# Altium schematic sheet NAVC_Peripherals.SchDoc
size A4; SheetNumber: 3; SheetTotal: 8
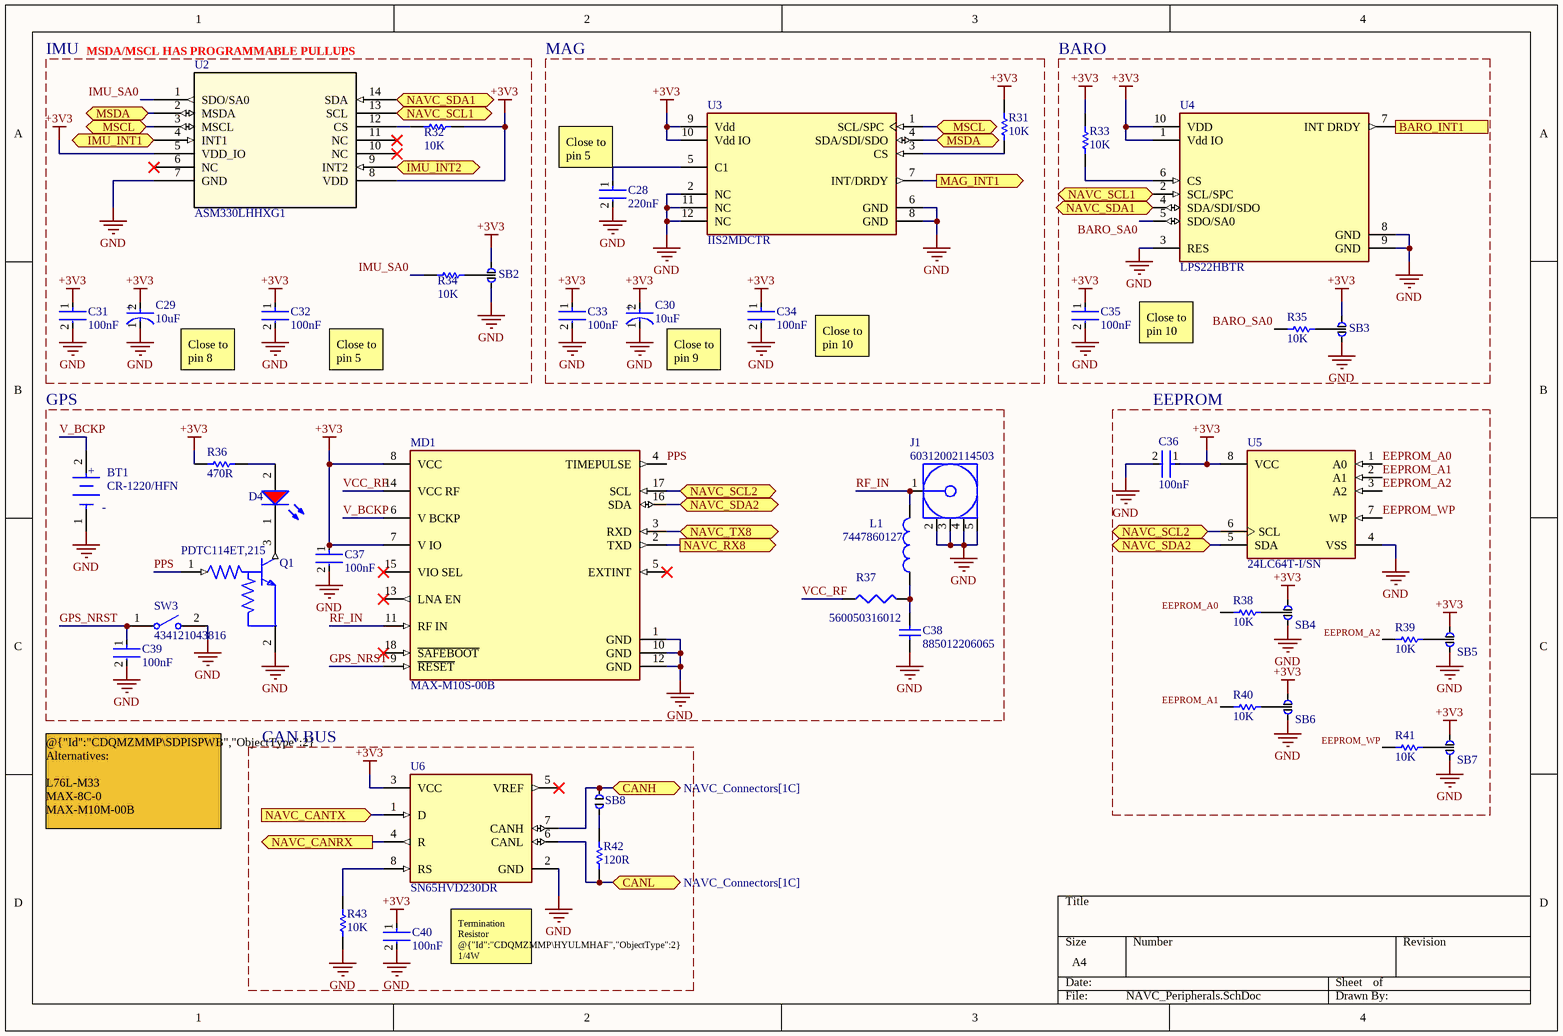
[diagram p0: NAVC_Peripherals.SchDoc]

## Parts
BT1  CR-1220/HFN  [FP-CR-1220-HFN-MFG]
C28  220nF  [FP-C0603C-CF-MFG]
C29  10uF  [FP-T491A106K006AT-MFG]
C30  10uF  [FP-T491A106K006AT-MFG]
C31  100nF  [FP-CGA3E-0_3-0_1-IPC_A]
C32  100nF  [FP-CGA3E-0_3-0_1-IPC_A]
C33  100nF  [FP-CGA3E-0_3-0_1-IPC_A]
C34  100nF  [FP-CGA3E-0_3-0_1-IPC_A]
C35  100nF  [FP-CGA3E-0_3-0_1-IPC_A]
C36  100nF  [FP-CGA3E-0_3-0_1-IPC_A]
C37  100nF  [FP-CGA3E-0_3-0_1-IPC_A]
C38  885012206065  [WCAP-CSGP_0603_L1.6W0.8H0.8_Reflow]
C39  100nF  [FP-CGA3E-0_3-0_1-IPC_A]
C40  100nF  [FP-CGA3E-0_3-0_1-IPC_A]
D4  150120SS75000  [WL-SMCW_1206_150120xx75000]  (value not drawn)
J1  60312002114503  [60312002114503]
L1  7447860127  [WE-MK_0603_L1.6W0.8H0.8]
MD1  MAX-M10S-00B  [FP-MAX-M10S-00B-MFG]
Q1  PDTC114ET,215  [FP-SOT23-MFG]
R31  10K  [RESC1609X50X30NL8T20]
R32  10K  [RESC1609X50X30NL8T20]
R33  10K  [RESC1609X50X30NL8T20]
R34  10K  [RESC1609X50X30NL8T20]
R35  10K  [RESC1609X50X30NL8T20]
R36  470R  [RESC1609X50X30NL8T20]
R37  560050316012  [WRIS-KSKE_0603_L1.6W0.8H0.45]
R38  10K  [RESC1608X55X25ML10T15]
R39  10K  [RESC1608X55X25ML10T15]
R40  10K  [RESC1608X55X25ML10T15]
R41  10K  [RESC1608X55X25ML10T15]
R42  120R  [RESC1608X55X25ML10T15]
R43  10K  [RESC1608X55X25ML10T15]
SB2  Solderbridge3P  [SolderBridge3P]  (value not drawn)
SB3  Solderbridge3P  [SolderBridge3P]  (value not drawn)
SB4  Solderbridge3P  [SolderBridge3P]  (value not drawn)
SB5  Solderbridge3P  [SolderBridge3P]  (value not drawn)
SB6  Solderbridge3P  [SolderBridge3P]  (value not drawn)
SB7  Solderbridge3P  [SolderBridge3P]  (value not drawn)
SB8  SolderbridgeOpen  [SolderBridgeOpen]  (value not drawn)
SW3  434121043816  [434121043816]
U2  ASM330LHHXG1  [LGA-14L_STM]
U3  IIS2MDCTR  [FP-LGA-12-DM00170568-MFG]
U4  LPS22HBTR  [FP-HLGA-10L-8479831-0]
U5  24LC64T-I/SN  [FP-C04-057-SN-MFG]
U6  SN65HVD230DR  [FP-D0008A-IPC_A]

## Blocks framed on the sheet
IMU: C29 C31 C32 R32 R34 SB2 U2
MAG: C28 C30 C33 C34 R31 U3
BARO: C35 R33 R35 SB3 U4
GPS: BT1 C37-C39 D4 J1 L1 MD1 Q1 R36 R37 SW3
EEPROM: C36 R38-R41 SB4-SB7 U5
CAN BUS: C40 R42 R43 SB8 U6

## Ports
BARO_INT1 (out, see NAVC_MCU[2A]), CANH (bidir, see NAVC_Connectors[1C]), CANL (bidir, see NAVC_Connectors[1C]), IMU_INT1 (bidir, see NAVC_MCU[2A]), IMU_INT2 (bidir, see NAVC_MCU[2A]), MAG_INT1 (out, see NAVC_MCU[2A]), MSCL (bidir, see NAVC_Peripherals[1A]), MSCL (bidir, see NAVC_Peripherals[3A]), MSDA (bidir, see NAVC_Peripherals[1A]), MSDA (bidir, see NAVC_Peripherals[3A]), NAVC_CANRX (out, see NAVC_MCU[1A]), NAVC_CANTX (in, see NAVC_MCU[1B]), NAVC_RX8 (out, see NAVC_MCU[1C], NAVC_MCU[2D]), NAVC_SCL1 (bidir, see NAVC_MCU[2A], NAVC_MCU[2D], NAVC_Peripherals[2A]), NAVC_SCL1 (bidir, see NAVC_MCU[2A], NAVC_MCU[2D], NAVC_Peripherals[3A]), NAVC_SCL2 (bidir, see NAVC_MCU[2C], NAVC_MCU[2D], NAVC_Peripherals[2B]), NAVC_SCL2 (bidir, see NAVC_MCU[2C], NAVC_MCU[2D], NAVC_Peripherals[3C]), NAVC_SDA1 (bidir, see NAVC_MCU[2A], NAVC_MCU[2D], NAVC_Peripherals[2A]), NAVC_SDA1 (bidir, see NAVC_MCU[2A], NAVC_MCU[2D], NAVC_Peripherals[3A]), NAVC_SDA2 (bidir, see NAVC_MCU[2C], NAVC_MCU[2D], NAVC_Peripherals[2B]), NAVC_SDA2 (bidir, see NAVC_MCU[2C], NAVC_MCU[2D], NAVC_Peripherals[3C]), NAVC_TX8 (bidir, see NAVC_MCU[1C], NAVC_MCU[2D])

## Nets
+3V3: C29.2(A) C30.2(A) C31.1 C32.1 C33.1 C34.1 C35.1 C36.1 C37.1 C40.1 MD1.7(V_IO) MD1.8(VCC) R31.2 R32.1 R33.2 R36.2 SB2.1 SB3.1 SB4.1 SB5.1 SB6.1 SB7.1 U2.5(VDD_IO) U2.8(VDD) U3.9(Vdd) U3.10(Vdd_IO) U4.1(Vdd_IO) U4.10(VDD) U5.8(VCC) U6.3(VCC)
GND: BT1.1(C) C28.2 C29.1(C) C30.1(C) C31.2 C32.2 C33.2 C34.2 C35.2 C36.2 C37.2 C38.1 C39.2 C40.2 J1.2(GND) J1.3(GND) J1.4(GND) J1.5(GND) MD1.1(GND) MD1.10(GND) MD1.12(GND) Q1.2(GND) R43.2 SB2.2 SB3.2 SB4.2 SB5.2 SB6.2 SB7.2 SW3.2 U2.7(GND) U3.2(NC) U3.6(GND) U3.8(GND) U3.11(NC) U3.12(NC) U4.3(RES) U4.8(GND) U4.9(GND) U5.4(VSS) U6.2(GND)
BARO_INT1: U4.7(INT_DRDY) ; port BARO_INT1
BARO_SA0: R35.2 U4.5(SDO/SA0)
CANH: SB8.2 U6.7(CANH) ; port CANH
CANL: R42.2 U6.6(CANL) ; port CANL
EEPROM_A0: R38.2 U5.1(A0)
EEPROM_A1: R40.2 U5.2(A1)
EEPROM_A2: R39.2 U5.3(A2)
EEPROM_WP: R41.2 U5.7(WP)
GPS_NRST: C39.1 MD1.9(~{RESET}) SW3.1
IMU_INT1: U2.4(INT1) ; port IMU_INT1
IMU_INT2: U2.9(INT2) ; port IMU_INT2
IMU_SA0: R34.2 U2.1(SDO/SA0)
MAG_INT1: U3.7(INT/DRDY) ; port MAG_INT1
MSCL: U2.3(MSCL) U3.1(SCL/SPC) ; port MSCL
MSDA: U2.2(MSDA) U3.4(SDA/SDI/SDO) ; port MSDA
NAVC_CANRX: U6.4(R) ; port NAVC_CANRX
NAVC_CANTX: U6.1(D) ; port NAVC_CANTX
NAVC_RX8: MD1.2(TXD) ; port NAVC_RX8
NAVC_SCL1: U2.13(SCL) U4.2(SCL/SPC) ; port NAVC_SCL1
NAVC_SCL2: MD1.17(SCL) U5.6(SCL) ; port NAVC_SCL2
NAVC_SDA1: U2.14(SDA) U4.4(SDA/SDI/SDO) ; port NAVC_SDA1
NAVC_SDA2: MD1.16(SDA) U5.5(SDA) ; port NAVC_SDA2
NAVC_TX8: MD1.3(RXD) ; port NAVC_TX8
PPS: MD1.4(TIMEPULSE) Q1.1(I)
RF_IN: J1.1(Signal) L1.2 MD1.11(RF_IN)
V_BCKP: BT1.2(A) MD1.6(V_BCKP)
VCC_RF: MD1.14(VCC_RF) R37.1
NetC28_1: C28.1 U3.5(C1)
NetC38_2: C38.2 L1.1 R37.2
NetD4_1: D4.1(K) Q1.3(O)
NetD4_2: D4.2(A) R36.1
NetR31_1: R31.1 U3.3(CS)
NetR32_2: R32.2 U2.12(CS)
NetR33_1: R33.1 U4.6(CS)
NetR34_1: R34.1 SB2.3
NetR35_1: R35.1 SB3.3
NetR38_1: R38.1 SB4.3
NetR39_1: R39.1 SB5.3
NetR40_1: R40.1 SB6.3
NetR41_1: R41.1 SB7.3
NetR42_1: R42.1 SB8.1
NetR43_1: R43.1 U6.8(RS)

Not connected (* = marked no-connect by the designer): MD1 5(EXTINT)* 13(LNA_EN)* 15(VIO_SEL)* 18(~{SAFEBOOT})*; U2 6(NC)* 10(NC)* 11(NC)*; U6 5(VREF)*

## Notes on the sheet
- (near U2) MSDA/MSCL HAS PROGRAMMABLE PULLUPS
- (near C28) Close to pin 5
- Close to pin 8
- Close to pin 5
- Close to pin 9
- Close to pin 10
- @{"Id":"CDQMZMMP\SDPISPWB","ObjectType":2} Alternatives:
  L76L-M33
  MAX-8C-0
  MAX-M10M-00B
- Termination Resistor @{"Id":"CDQMZMMP\HYULMHAF","ObjectType":2} 1/4W
- (in symbol CMP-03017-000032-1) +
- (in symbol CMP-05417-000010-1) +; -

## Library data of the parts
BT1 = CMP-05417-000010-1: BATTERY LITHIUM 3V COIN 12.5MM; Manufacturer: Panasonic; Standoff Height: 2.9mm; Temperature Range High: +60°C; Temperature: -30°C to +60°C; Device Class L2: unset; Height: 5.5mm; Category: Batt; Device Class L3: unset; Package: CR-1220/HFN; ComponentLink2URL: https://industrial.panasonic.com/cdbs/www-data/pdf2/AAA4000/AAA4000D138.PDF; ComponentLink2Description: Datasheet; Temperature Range Low: -30°C; Mouser Description: CR1220 Series Ø 12.5 mm 3 V 35 mAh Non-Rechargeable Lithium Coin Cell Battery; Octopart: https://octopart.com/cr-1220%2Fhfn-panasonic-13183313; Manufacturer Part Number: CR-1220/HFN; Automotive: No; Digikey Description: BATTERY LITHIUM 3V COIN 12.5MM; Device Class L1: Passive Components
C28 = CMP-2006-03146-2: CAP CER 0.22UF 25V 10% X7R 0603; Manufacturer: KEMET; Manufacturer Part Number: C0603C224K3RACTU; Temperature Coefficient: 30ppm/°C; Value: 0.22 μF; Material: Ceramic; Tolerance: 0.1; Automotive Grade: Grade 1; Device Class L2: Capacitors; Automotive: Yes; RoHS: TRUE; Digikey Description: CAP CER 0.22UF 25V 10% X7R 0603; Package: C0603C-CF; Height: 0.87mm; Temperature Characteristic: X7R; Mouser Description: Multilayer Ceramic Capacitors MLCC - SMD/SMT 25volts 0.22uF X7R 10%; Device Class L3: Ceramic Capacitors; Lead Free: Yes; Capacitance: 0.22 μF; Device Class L1: Passive Components; ComponentLink2Description: Datasheet; Temperature: -55°C to +125°C; Voltage Rating: 25 V; Temperature Range Low: -55°C; ComponentLink2URL: https://api.kemet.com/component-edge/download/datasheet/C0603C100J5GACAUTO.pdf; Octopart: https://octopart.com/c0603c224k3ractu-kemet-129141; Temperature Range High: +125°C; Category: Cap
C29 C30 = CMP-03017-000032-1: CAP TANT 10UF 10% 6.3V 1206; Life (Hours): 2000Hour; Polarity: Polar; Dielectric Material: Tantalum; Leakage Current: 600nA; Dissipation Factor: 6%; ESR (Equivalent Series Resistance): 4R; Lead Free: Lead Free; Features: General Purpose; Length: 3.2mm; Mount: Surface Mount; Number of Pins: 2; RoHS Compliant: Yes; Case/Package: 1206; Width: 1.6mm; Capacitance: 10uF; REACH SVHC: No SVHC; Voltage Rating (DC): 6.3V; Max Operating Temperature: 125°C; Height - Seated (Max): 0.071inch; Termination: SMD/SMT; Radiation Hardening: No; Tolerance: 10%; Min Operating Temperature: -55°C; Lead Pitch: 1.2mm; Voltage: 6.3V; Depth: 1.6mm; Case Code (Imperial): 1206; Case Code (Metric): 3216; Packaging: Tape and Reel; Height: 1.6mm; Voltage Rating: 6.3V; Package Quantity: 1
C31-C37 C39 C40 = CMP-2000-07546-2: Cap Ceramic 100nF 50V X7R 10% Pad SMD 0603 +125°C Automotive T/R; Weight: 7.1E-05oz; Composition: Ceramic; Max Operating Temperature: 125°C; Termination: SMD/SMT; Dielectric: X7R; Length: 1.6mm; Package Quantity: 1; REACH SVHC: No SVHC; Lead Free: Lead Free; Case Code (Metric): 1608; Min Operating Temperature: -55°C; Packaging: Tape and Reel; Tolerance: 10%; Voltage Rating: 50V; Case Code (Imperial): 0603; Capacitance: 100nF; Case/Package: 0603; Voltage Rating (DC): 50V; Depth: 0.8mm; Radiation Hardening: No; Ratings: AEC-Q200; Mount: Surface Mount; Voltage: 50V; Thickness: 0.035inch; Width: 0.8mm; Height: 0.8mm
C38 = CMP-03913-53914774-1: 885012206065 Cap Cer 10000PF 25V X7R 0603; Insulation Resistance: 10GΩ; Tolerance: 10%; Capacitance: 10nF; REACH SVHC: Unknown; Height: 800µm; NexarPartId: 53914774; Case Code (Metric): 1608; Voltage Rating: 25V; Case Code (Imperial): 0603; Width: 800µm; Max Operating Temperature: 125°C; Min Operating Temperature: -55°C; Mount: Surface Mount; Voltage Rating (DC): 25V; Length: 1.6mm; Dielectric: X7R; Case/Package: 0603; Packaging: Tape & Reel (TR); RoHS: Compliant; Thickness: 939.8µm
D4 = CMP-1426-00017-3: Led, Red, 630 Nm, 1.9 V, 30 Ma, 60 Mcd Rohs Compliant: Yes; Forward Current: 100mA; Max Reverse Voltage (DC): 5V; Lens Style: Clear, Rectangular; Viewing Angle: 140°; Luminous Intensity: 60mcd; Peak Wavelength: 645nm; Forward Voltage: 1.9V; Test Current: 20mA; Dominant Wavelength: 630nm; Case Code (Imperial): 1206; Length: 3.2mm; Mount: Surface Mount; Case Code (Metric): 3216; Case/Package: 1206; Min Operating Temperature: -40°C; Width: 1.6mm; Color: Red; Height: 680µm; REACH SVHC: Unknown; Max Operating Temperature: 85°C; Wavelength: 630nm; RoHS: Compliant; Packaging: Tape and Reel
J1 = CMP-207975-000002-2: SMA PCB THT JACK STRAIGHT WR-SMA; NexarPartId: 97004423; Insertion Loss (dB): 0.14dB; Number of Contacts: 1; Voltage Rating: 335V; Impedance: 50Ω; Frequency: 18GHz; Dielectric Material: PTFE; Insulation Resistance: 5GΩ; Orientation: Straight; Contact Material: Gold, Nickel; Min Operating Temperature: -65°C; Insulation Material: PTFE; Connector Type: SMA; Max Operating Temperature: 165°C; Height: 9.76mm
L1 = CMP-03913-110288215-1: 7447860127 Inductor, Multilayer, 27Nh, 0.3A, 0603 Rohs Compliant: Yes; Current Rating: 500mA; Min Operating Temperature: -55°C; NexarPartId: 110288215; Height: 800µm; Inductance: 27nH; Length: 1.6mm; RoHS: Compliant; Width: 800µm; Ambient Temperature Range Low: -55°C; Ambient Temperature Range High: 105°C; Max Operating Temperature: 125°C
MD1 = CMP-207130-000026-1: GNSS LCC RX, ROM, TCXO, LNA, SAW
Q1 = CMP-11424-78740999-1: PDTC114ET,215 Transistor NPN - Pre-Biased, SOT-23 (TO-236AB) 50V 100mA250mW Surface Mount; Manufacturer Lifecycle Status: RELEASED FOR SUPPLY; Power Dissipation: 250mW; hFE Min: 30; Collector Emitter Saturation Voltage: 150mV; Max Junction Temperature (Tj): 150°C; Number of Elements: 1; Max Collector Current: 100mA; Emitter Base Voltage (VEBO): 10V; Height: 1.1mm; Number of Pins: 3; Lifecycle Status: Production; Ambient Temperature Range High: 150°C; RoHS: Non-Compliant; Polarity: NPN; Collector Base Voltage (VCBO): 50V; Collector Emitter Voltage (VCEO): 50V; NexarPartId: 78740999; Schedule B: 8541210080, 8541210080; Packaging: Digi-Reel®
R31-R36 = CMP-2000-03816-5: Chip Resistor, 0 Ohm, Jumper, 100 mW, -55 to 155 degC, 0603 (1608 Metric), RoHS, Tape and Reel; Manufacturer: Vishay Semiconductor; Voltage Rating: 75 V; Package Quantity: 5000; DatasheetVersion: 06/2012; Min Operating Temperature: -55 degC; ComponentLink1URL: http://www.vishay.com/; Mounting Technology: Surface Mount; Height: 0.45 mm; ComponentLink1Description: Manufacturer URL; REACH SVHC: Unknown; PackageReference: 0603; Packaging: Tape and Reel; Max Operating Temperature: 155 degC; Mount: Surface Mount; ComponentLink2Description: Datasheet; PackageDescription: 2-Pin Surface Mount Device, Body 1.575 x 0.85 mm; Length: 1.55 mm; ComponentLink2URL: http://www.vishay.com/docs/20035/dcrcwe3.pdf; Pins: 2; RoHSCompliant: true
R37 = CMP-207829-000001-2: WRIS-KSKE Thick Film Resistors; NexarPartId: 107086665; Current Rating: 150mA; Voltage Rating: 1.5811V; Tolerance: 1%; Resistance: 10Ω; Power Rating: 250mW; Temperature Coefficient: 100ppm/°C; Composition: Thick Film; Length: 1.6mm; RoHS: Compliant; Height: 450µm; Max Operating Temperature: 155°C; Min Operating Temperature: -55°C; Width: 800µm; Case/Package: 0603
R38-R43 = CMP-2100-03667-1: Chip Resistor, 0 Ohm, +/- 5%, 0.1 W, -55 to 155 degC, 0603 (1608 Metric), RoHS, Tape and Reel; Manufacturer: Yageo; Temperature Coefficient: 200ppm/degreesC; Voltage Rating: 50V; Power Rating: 100mW; Resistance: 0mOhm; Width: 0.8mm; Max Operating Temperature: 155degC; Tolerance: 5%; Package Reference: 0603; Height: 0.45mm; Depth: 0.8mm; Package Description: 2-Pin Surface Mount Device, Body 1.6 x 0.8 mm; Termination: SMD/SMT; Package Quantity: 5000; Case/Package: 0603; Case Code (Imperial): 0603; Radiation Hardening: No; Number of Pins: 2; Length: 1.6mm; Lead Free: LeadFree; Voltage Rating (DC): 50V; Military Standard: Not; Datasheet URL: http://www.yageo.com/NewPortal/yageodocoutput?fileName=/pdf/R-Chip/PYu-RC_Group_51_RoHS_L_5.pdf; Manufacturer URL: http://www.yageo.com/; Packaging: TapeandReel; Case Code (Metric): 1608; Min Operating Temperature: -55degC; Composition: ThickFilm; RoHSCompliant: true; Contact Plating: Tin; Datasheet Version: Rev. 5, 10/2016; REACH SVHC: NoSVHC
SW3 = CMP-1459-00005-3: Switch Tactile Spst-no 0.05A 12V; Contact Resistance: 100mΩ; Current Rating: 50mA; Operating Force: 160N; Packaging: Tape and Reel; Width: 6mm; Voltage Rating: 12V; Min Operating Temperature: -40°C; RoHS: Compliant; Height: 4.3mm; Insulation Resistance: 100MΩ; Contact Plating: Silver; Contact Current Rating: 50mA; Max Operating Temperature: 85°C
U2 = ASM330LHHXG1: No Description Available; Mfr_Name: STMicroelectronics; Type: Motion Sensors; RefDes: RefDes
U3 = CMP-12173-000003-1: SENSOR MR I2C/SPI 12LGA; Axis: X, Y, Z; Output Type: SPI; Sensing Method: Magnetoresistive; Resolution: 16b; Case/Package: LGA; Min Operating Temperature: -40°C; Packaging: Cut Tape; Number of Pins: 12; Max Operating Temperature: 85°C; RoHS Compliant: Yes
U4 = CMP-12182-000004-1: MEMS NANO PRESSURE SENSOR: 260-1; Manufacturer: STMicroelectronics; Sensor Output: I2C,SPI; Port Style: No Port; Max Supply Voltage: 3.6V; Operating Supply Current: 3-12uA; Min Supply Voltage: 1.7V; Device Class L3: unset; Device Class L1: Sensors; Manufacturer Part Number: LPS22HBTR; Temperature Range High: +85°C; Digikey Description: MEMS NANO PRESSURE SENSOR: 260-1; Device Class L2: Pressure Sensors; RoHS: TRUE; Lead Free: Yes; Height: 0.8mm; Automotive: No; Octopart: https://octopart.com/lps22hbtr-stmicroelectronics-51851131; Package: HLGA-10L-8479831; Temperature Range Low: -40°C; Category: IC; Temperature: -40°C to +85°C; ComponentLink2Description: Datasheet; ComponentLink2URL: https://www.st.com/resource/en/datasheet/lps22hb.pdf; Footprint Url: https://www.st.com/content/ccc/resource/technical/document/technical_note/73/17/9c/16/dd/96/4a/01/CD00134799.pdf/files/CD00134799.pdf/jcr:content/translations/en.CD00134799.pdf
U5 = CMP-0159-00199-2: IC EEPROM 64K I2C 400KHZ 8SOIC; Manufacturer: Microchip Technology; Min Supply Voltage: 2.5V; Interface: I2C,2-Wire; Access Time: 900ns; Memory Size: 64Kbits; Max Supply Voltage: 5.5V; Nominal Supply Current: 0.05-100uA; Standoff Height: 0.1mm; Temperature: -40°C to +85°C; Automotive: No; Ambient Temperature Range Low: -40°C; Device Class L1: Integrated Circuits (ICs); Footprint 1 Description: SOIC, 8-Leads, Body 4.9x3.8mm, Pitch 1.27mm, IPC High Density; Octopart: https://octopart.com/24lc64t-i%2Fsn-microchip-451854; Footprint Url: http://ww1.microchip.com/downloads/en/DeviceDoc/08L_SOIC_150_3dot9mm_SN_C04-00057e.pdf; Footprint 0 Description: SOIC, 8-Leads, Body 4.9x3.8mm, Pitch 1.27mm, IPC Medium Density; Memory Type: EEPROM; ComponentLink2Description: Datasheet; Digikey Description: IC EEPROM 64K I2C 400KHZ 8SOIC; Manufacturer Part Number: 24LC64T-I/SN; Temperature Range Low: -40°C; Footprint 2 Description: SOIC, 8-Leads, Body 4.9x3.8mm, Pitch 1.27mm, IPC Low Density; ComponentLink2URL: http://ww1.microchip.com/downloads/en/DeviceDoc/21189T.pdf; RoHS: TRUE; Device Class L2: Memory; Ambient Temperature Range High: +85°C; Mouser Description: EEPROM 8kx8 - 2.5V; Lead Free: Yes; Temperature Range High: +85°C; Frequency: 400kHz; Height: 1.75mm; Package: C04-057-SN; Ipc Land Pattern Name: SOIC127P600X175-8; Category: IC; Device Class L3: EEPROM
U6 = CMP-0315-00015-3: IC TRANSCEIVER HALF 1/1 8SOIC; Number of Transceivers: 1; Operating Supply Voltage: 3.3V; Number of I/Os: 2; Max Supply Current: 17mA; Max Supply Voltage: 3.6V; Min Supply Voltage: 3V; Data Rate: 1Mbps; Min Operating Temperature: -40°C; Packaging: Tape and Reel; Lead Free: Lead Free; Number of Transmit Buffers: 1; Max Operating Temperature: 85°C; Number of Receive Buffers: 1; Number of Pins: 8; Package Quantity: 1; Radiation Hardening: No; Case/Package: D; REACH SVHC: No SVHC; Weight: 0.002561oz; Termination: SMD/SMT; Contact Plating: Gold; Nominal Supply Current: 17mA; Number of Receivers: 1; Number of Drivers: 1